# EasyEDA Pro project ExtBoard-001_2024-04-03.epro, schematic Schematic-ExtBoard-001

## Sheets
1 USBHub: Create Date: 2024-03-18; Page Name: USBHub; Project Name: ExtBoard-001; Schematic Name: Schematic-ExtBoard-001; Update Date: 2024-03-18; Company: 嘉立创EDA; Page Size: A4; Version: V1.0
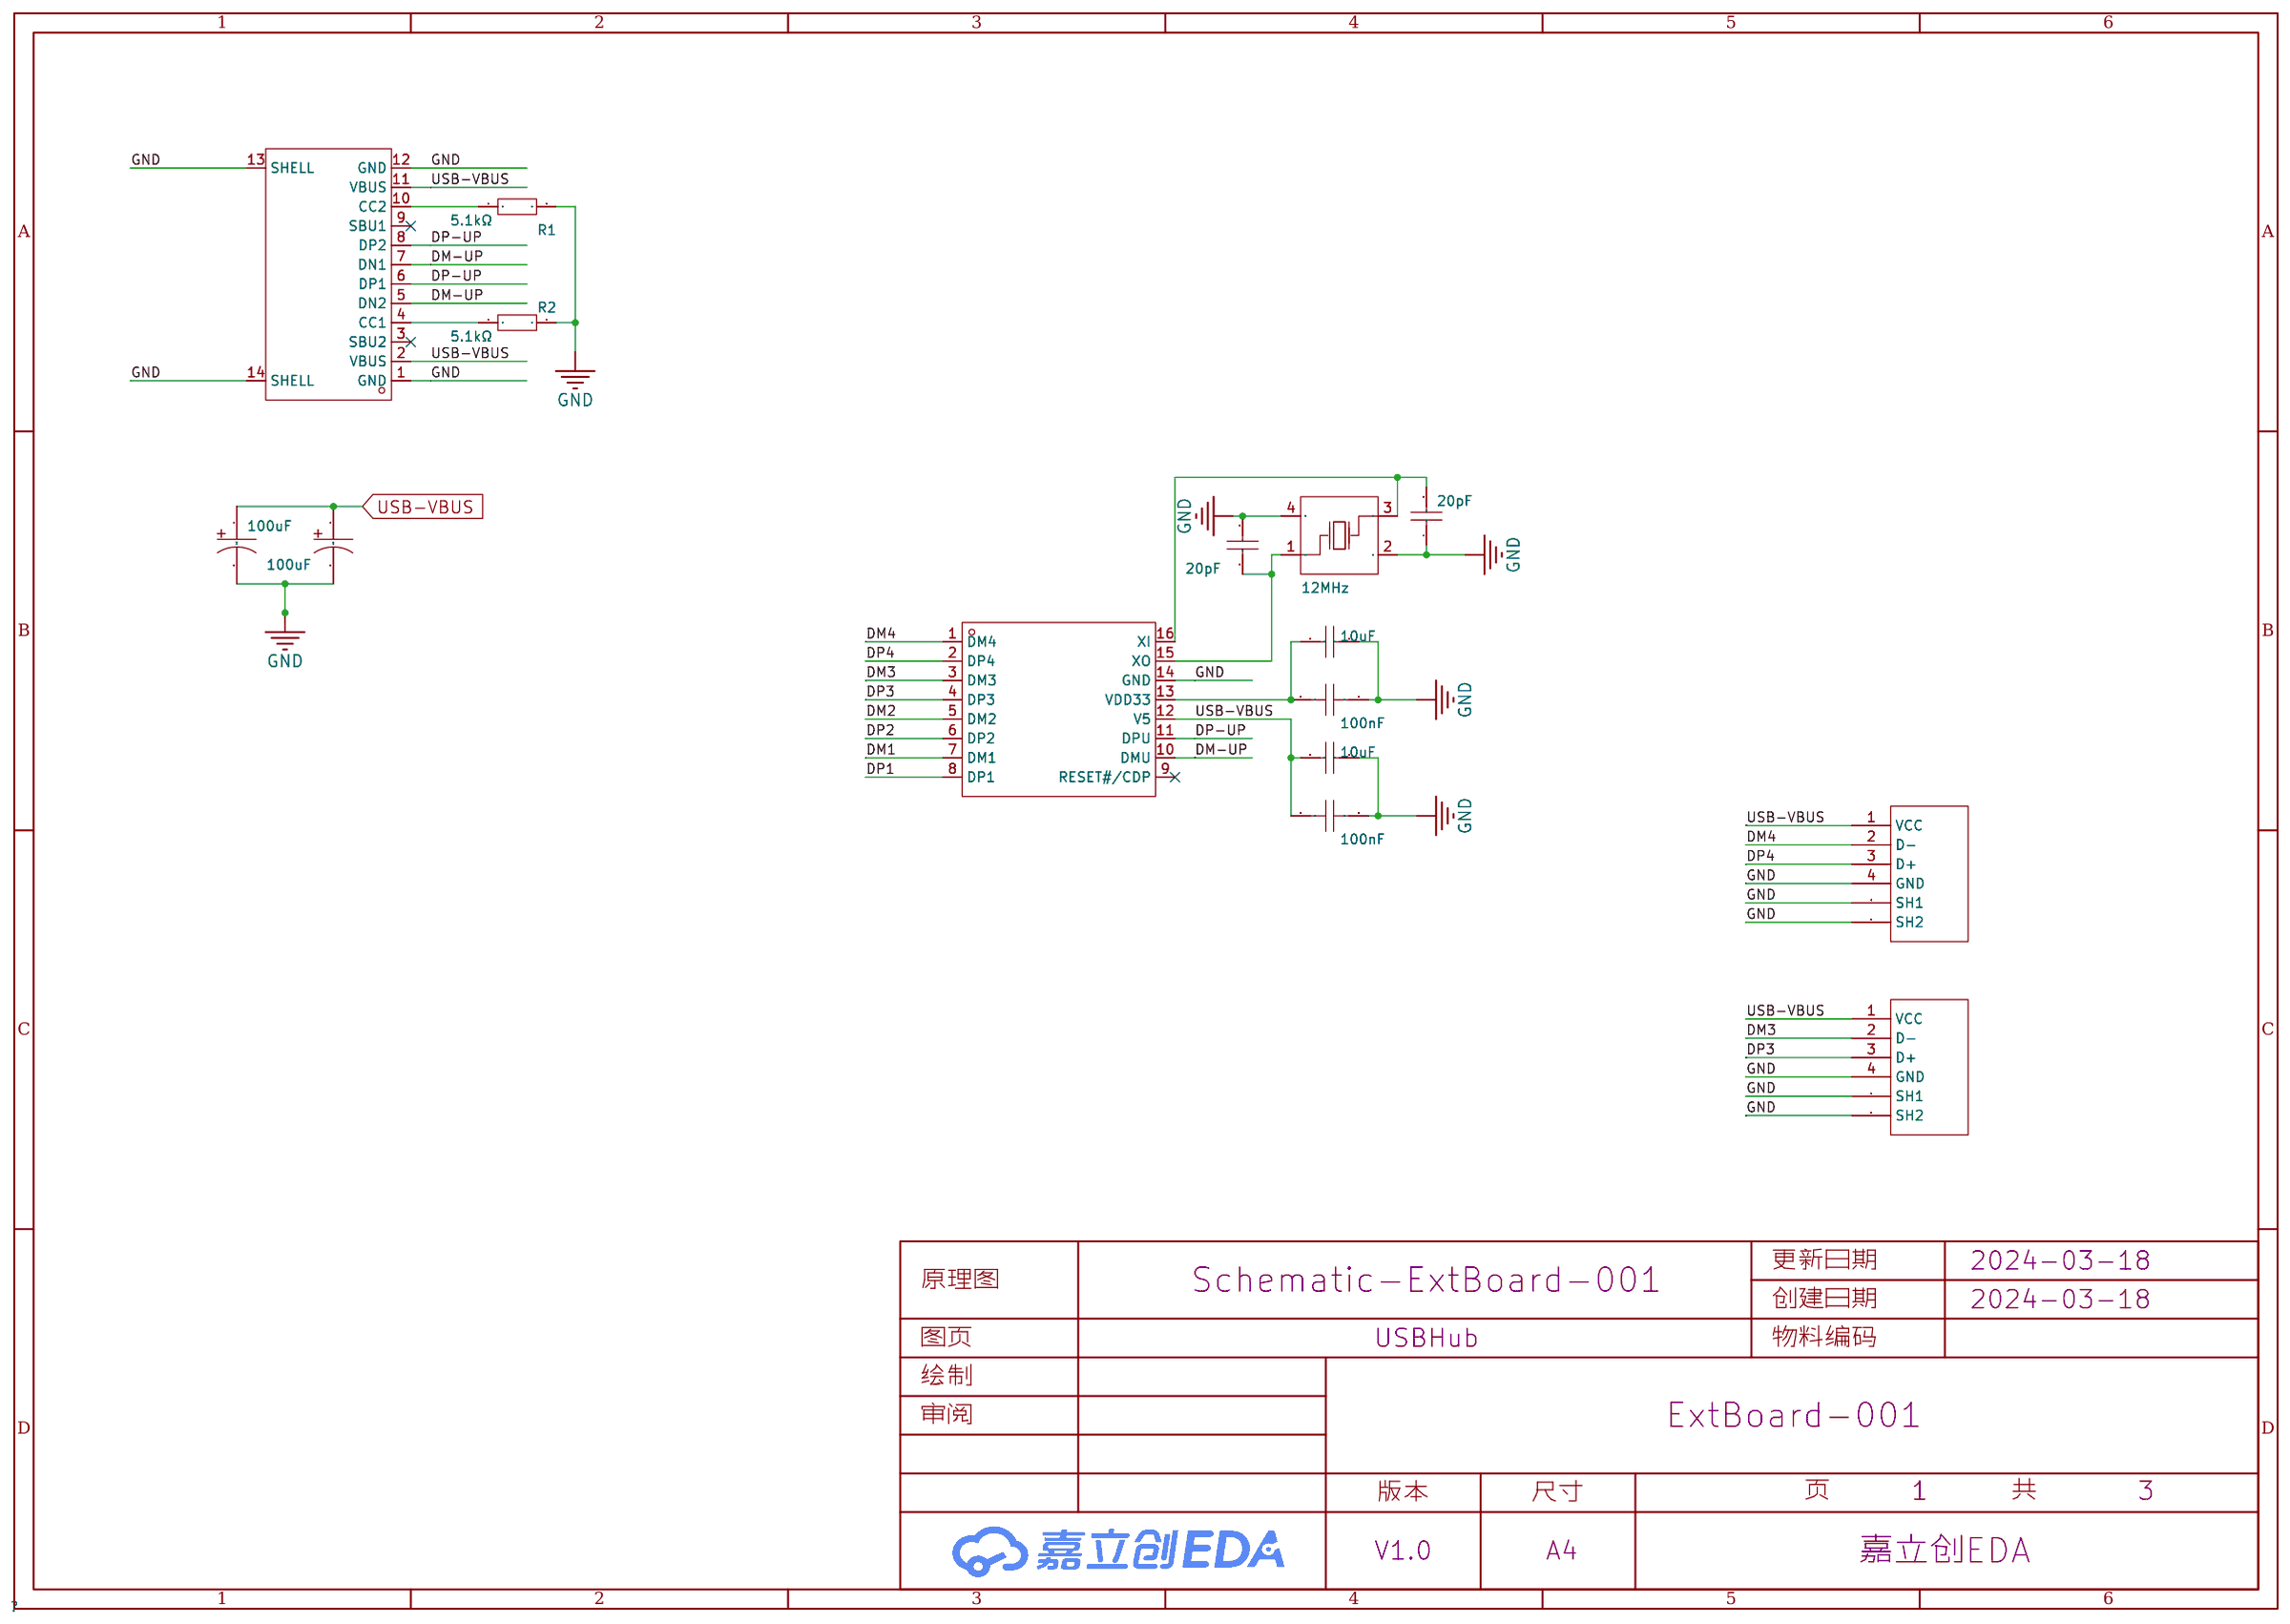
[diagram p0: USBHub]
2 Power: Page Name: Power
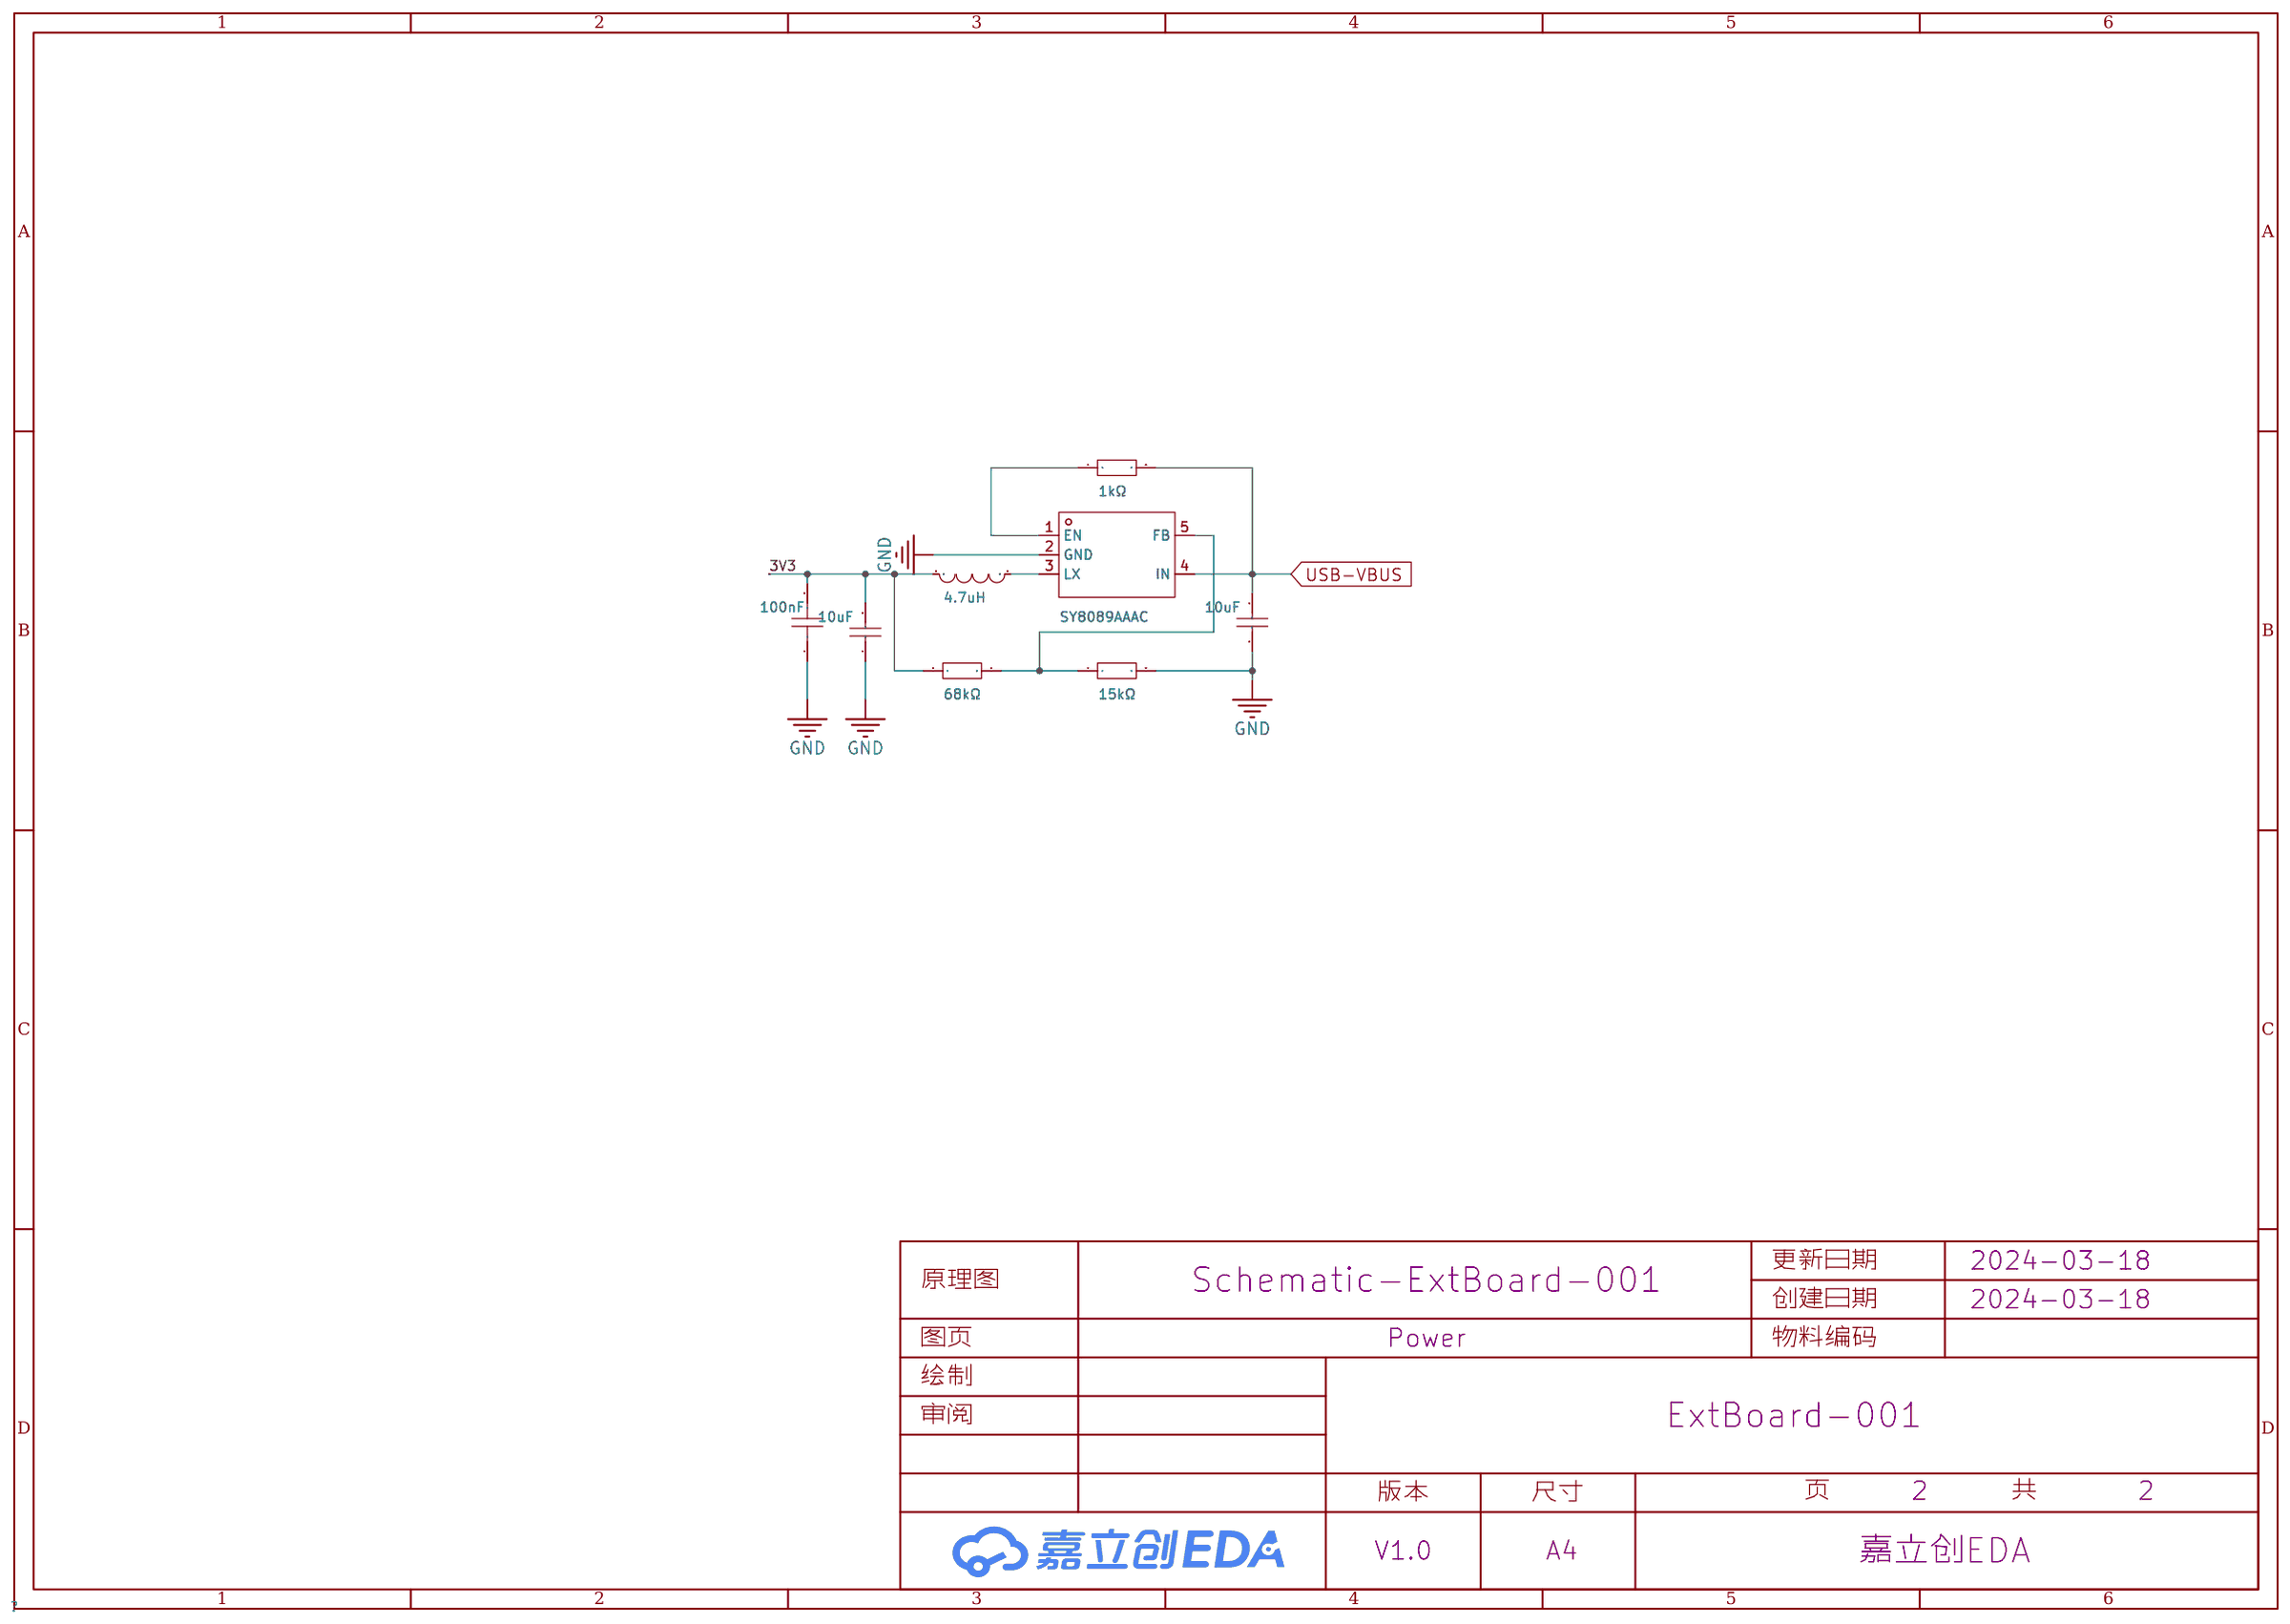
[diagram p1: Power]
3 DAPLink: Page Name: DAPLink; Update Date: 2024-03-27
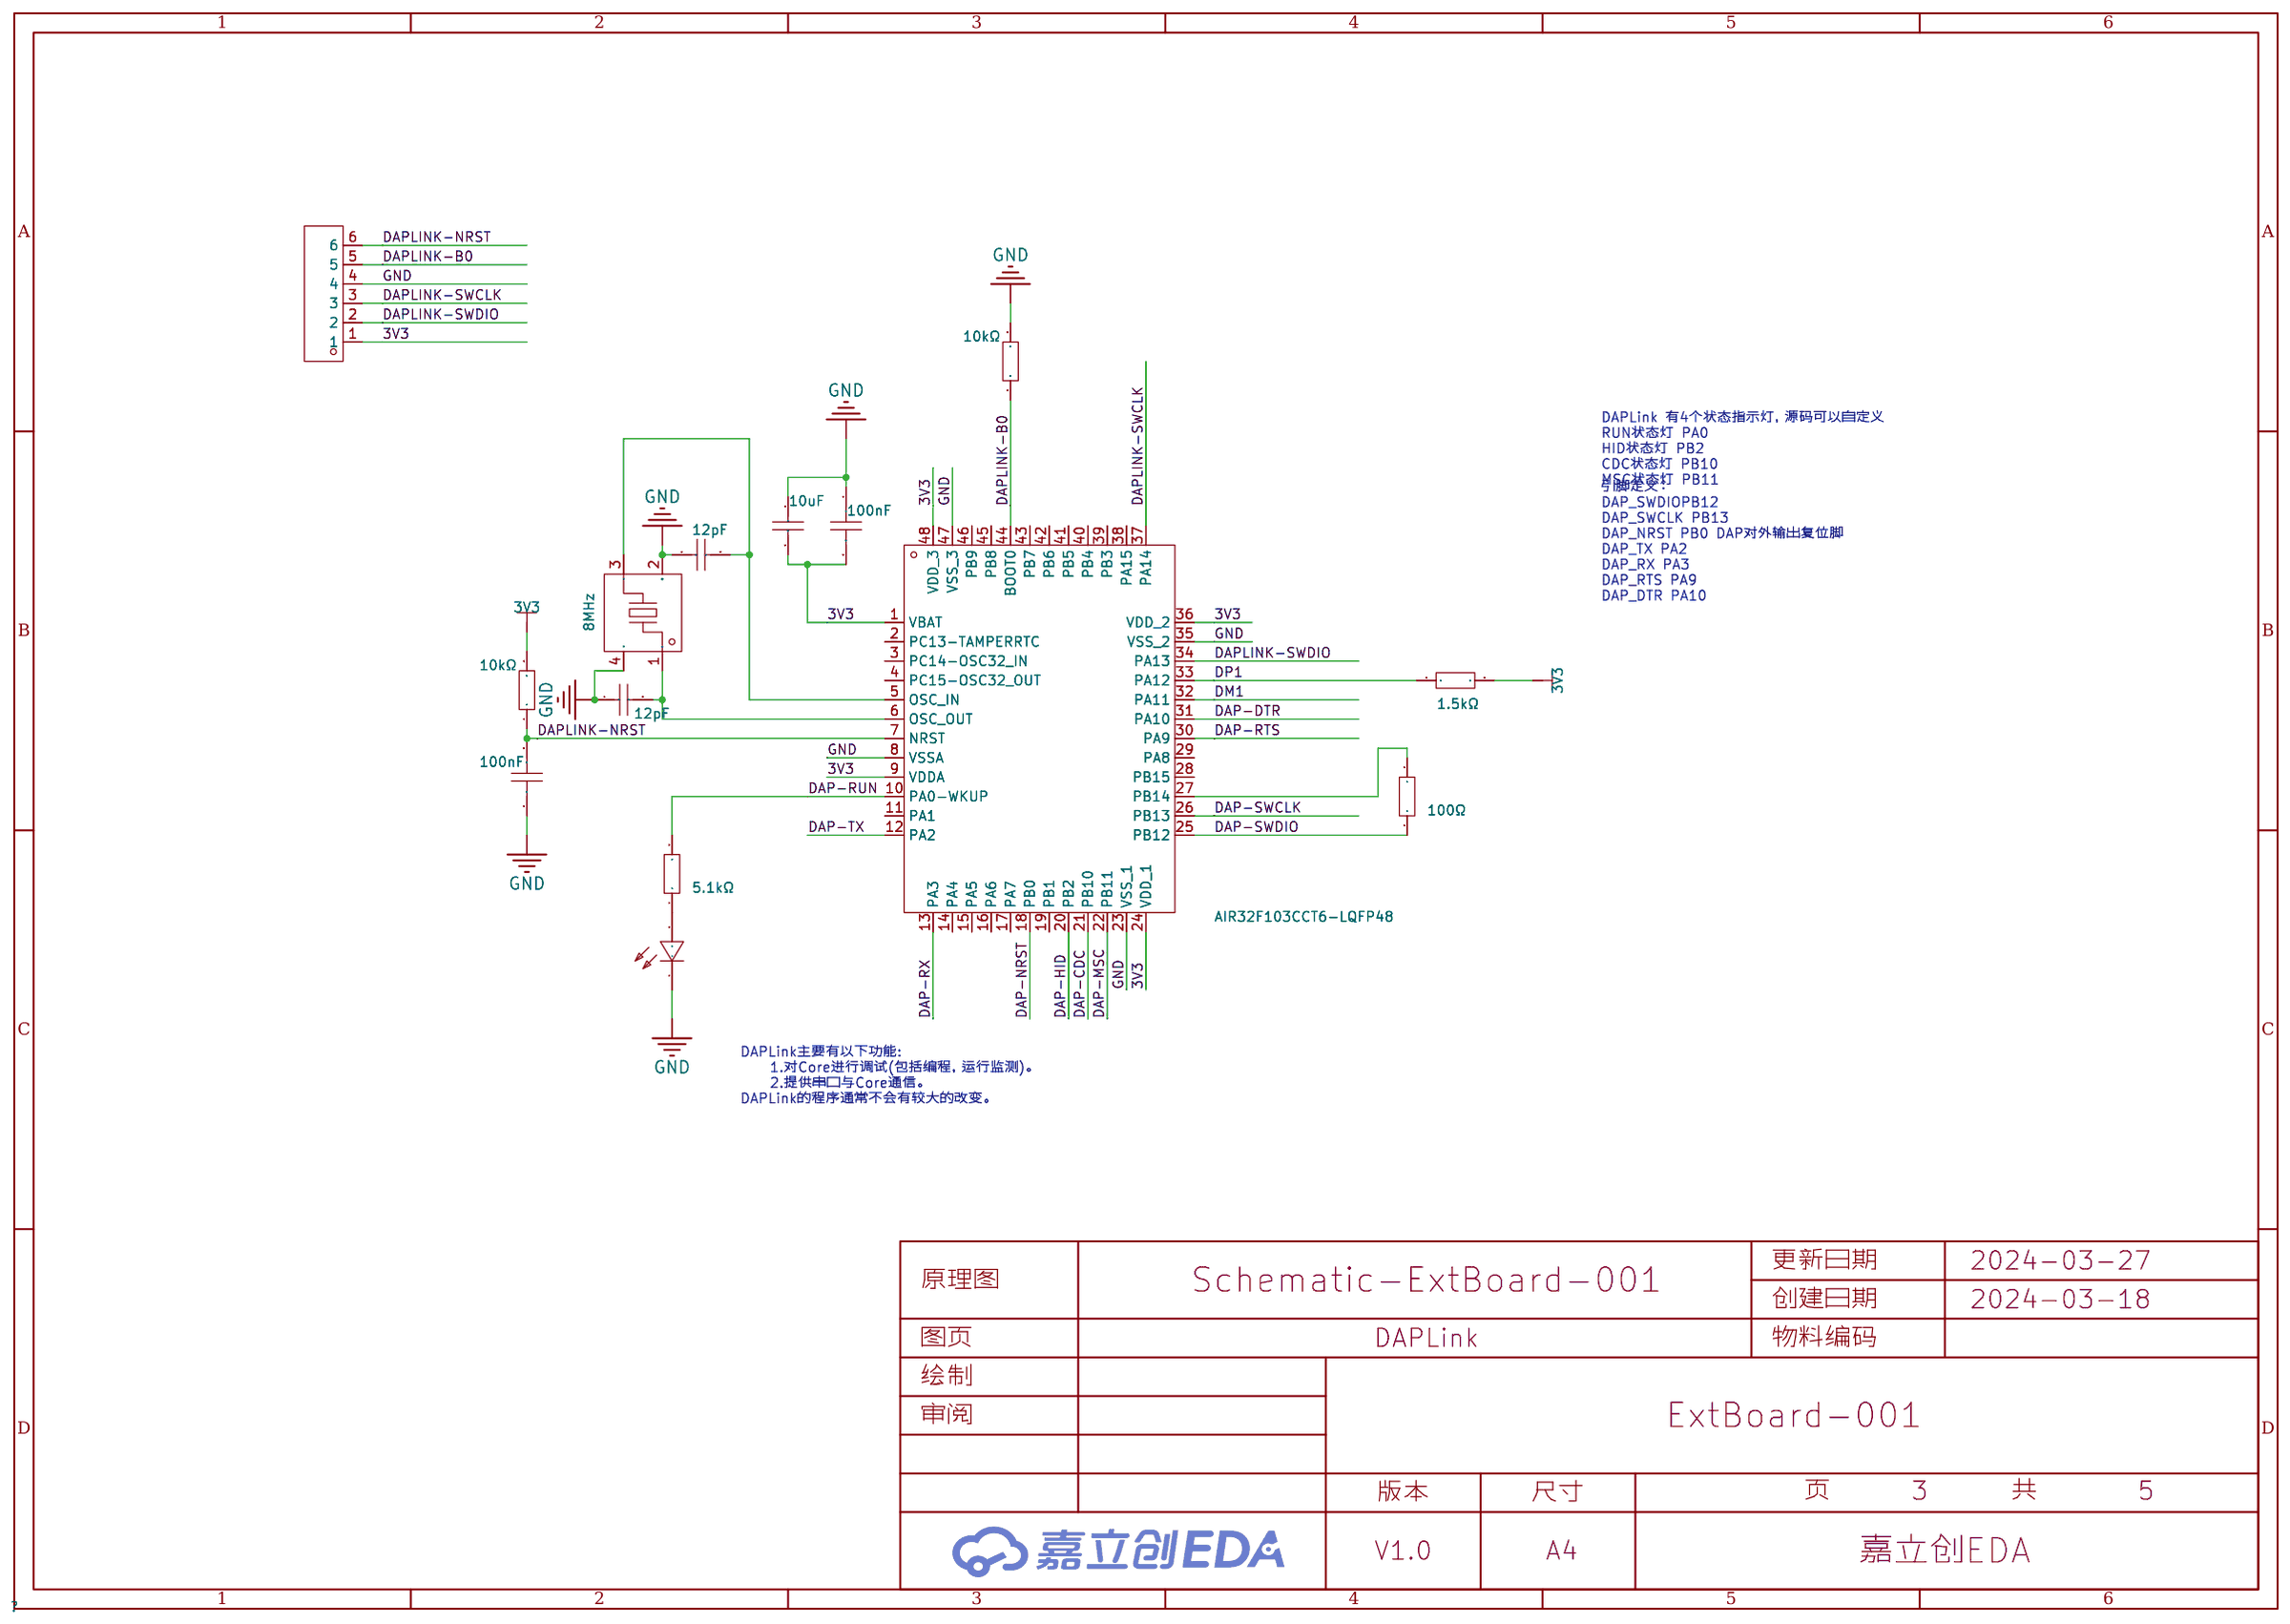
[diagram p2: DAPLink]
4 Core: Create Date: 2024-03-19; Page Name: Core; Update Date: 2024-04-02
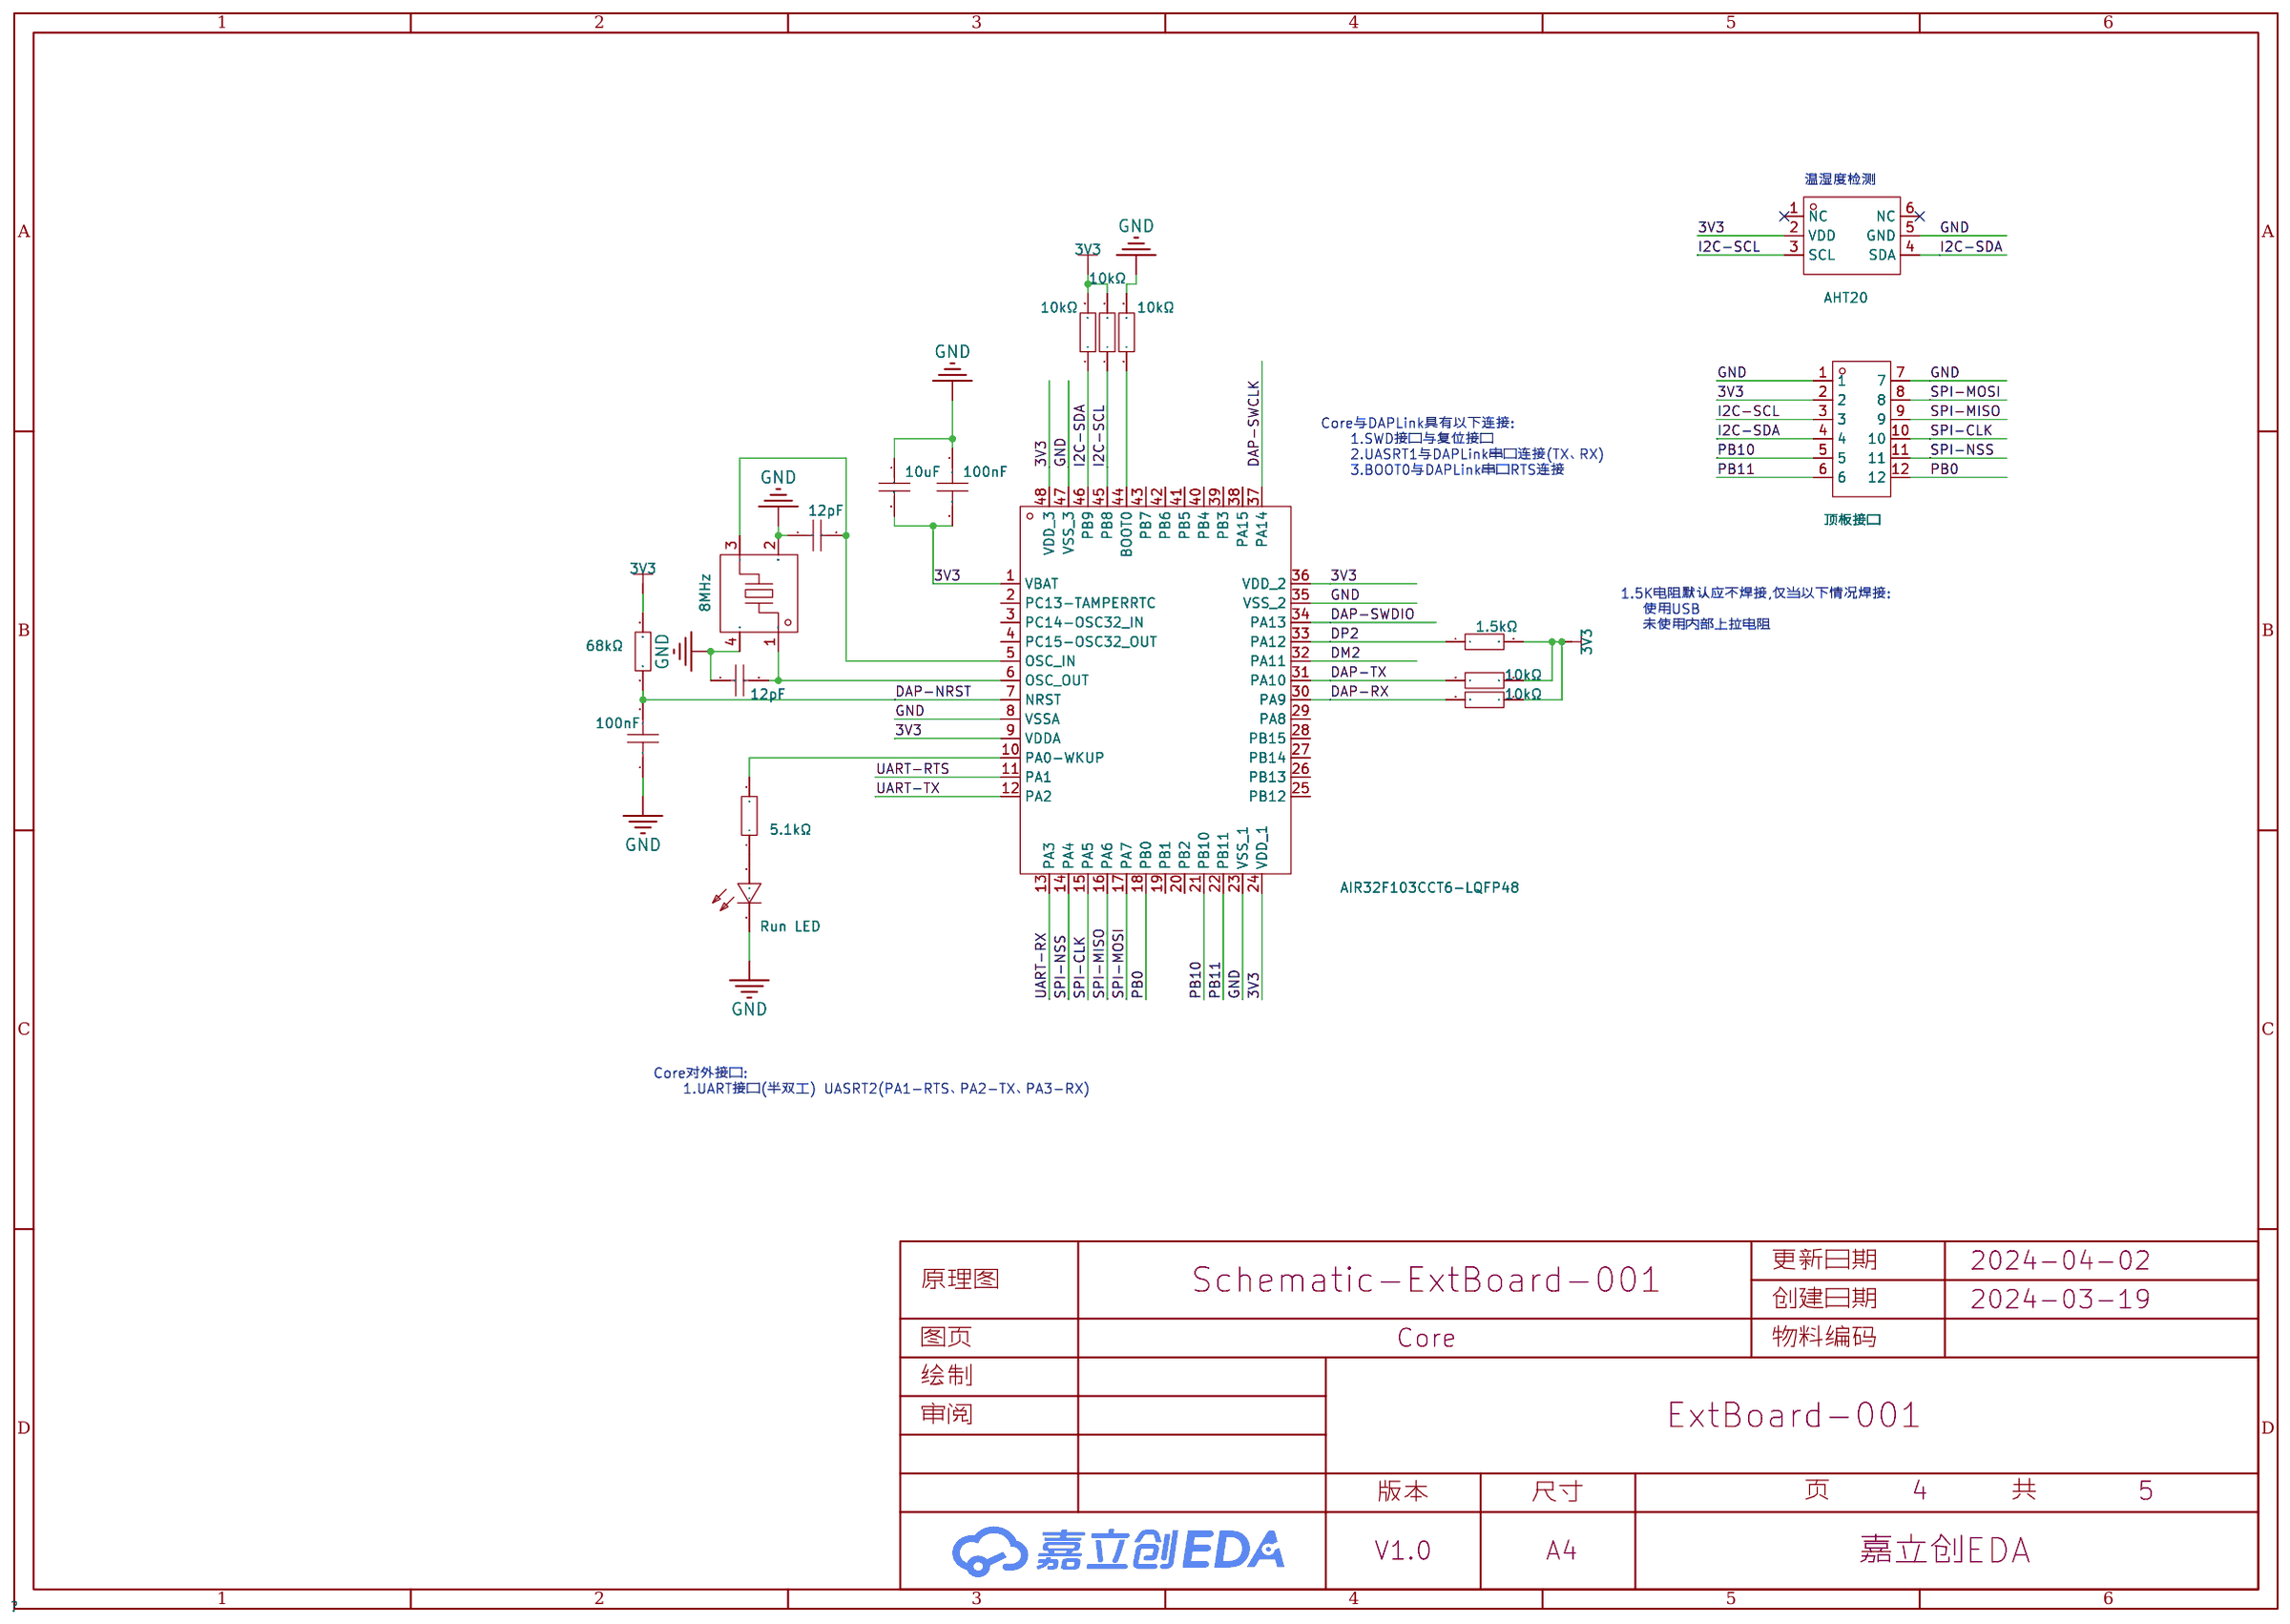
[diagram p3: Core]
5 RS485: Create Date: 2024-03-19; Page Name: RS485; Update Date: 2024-03-19
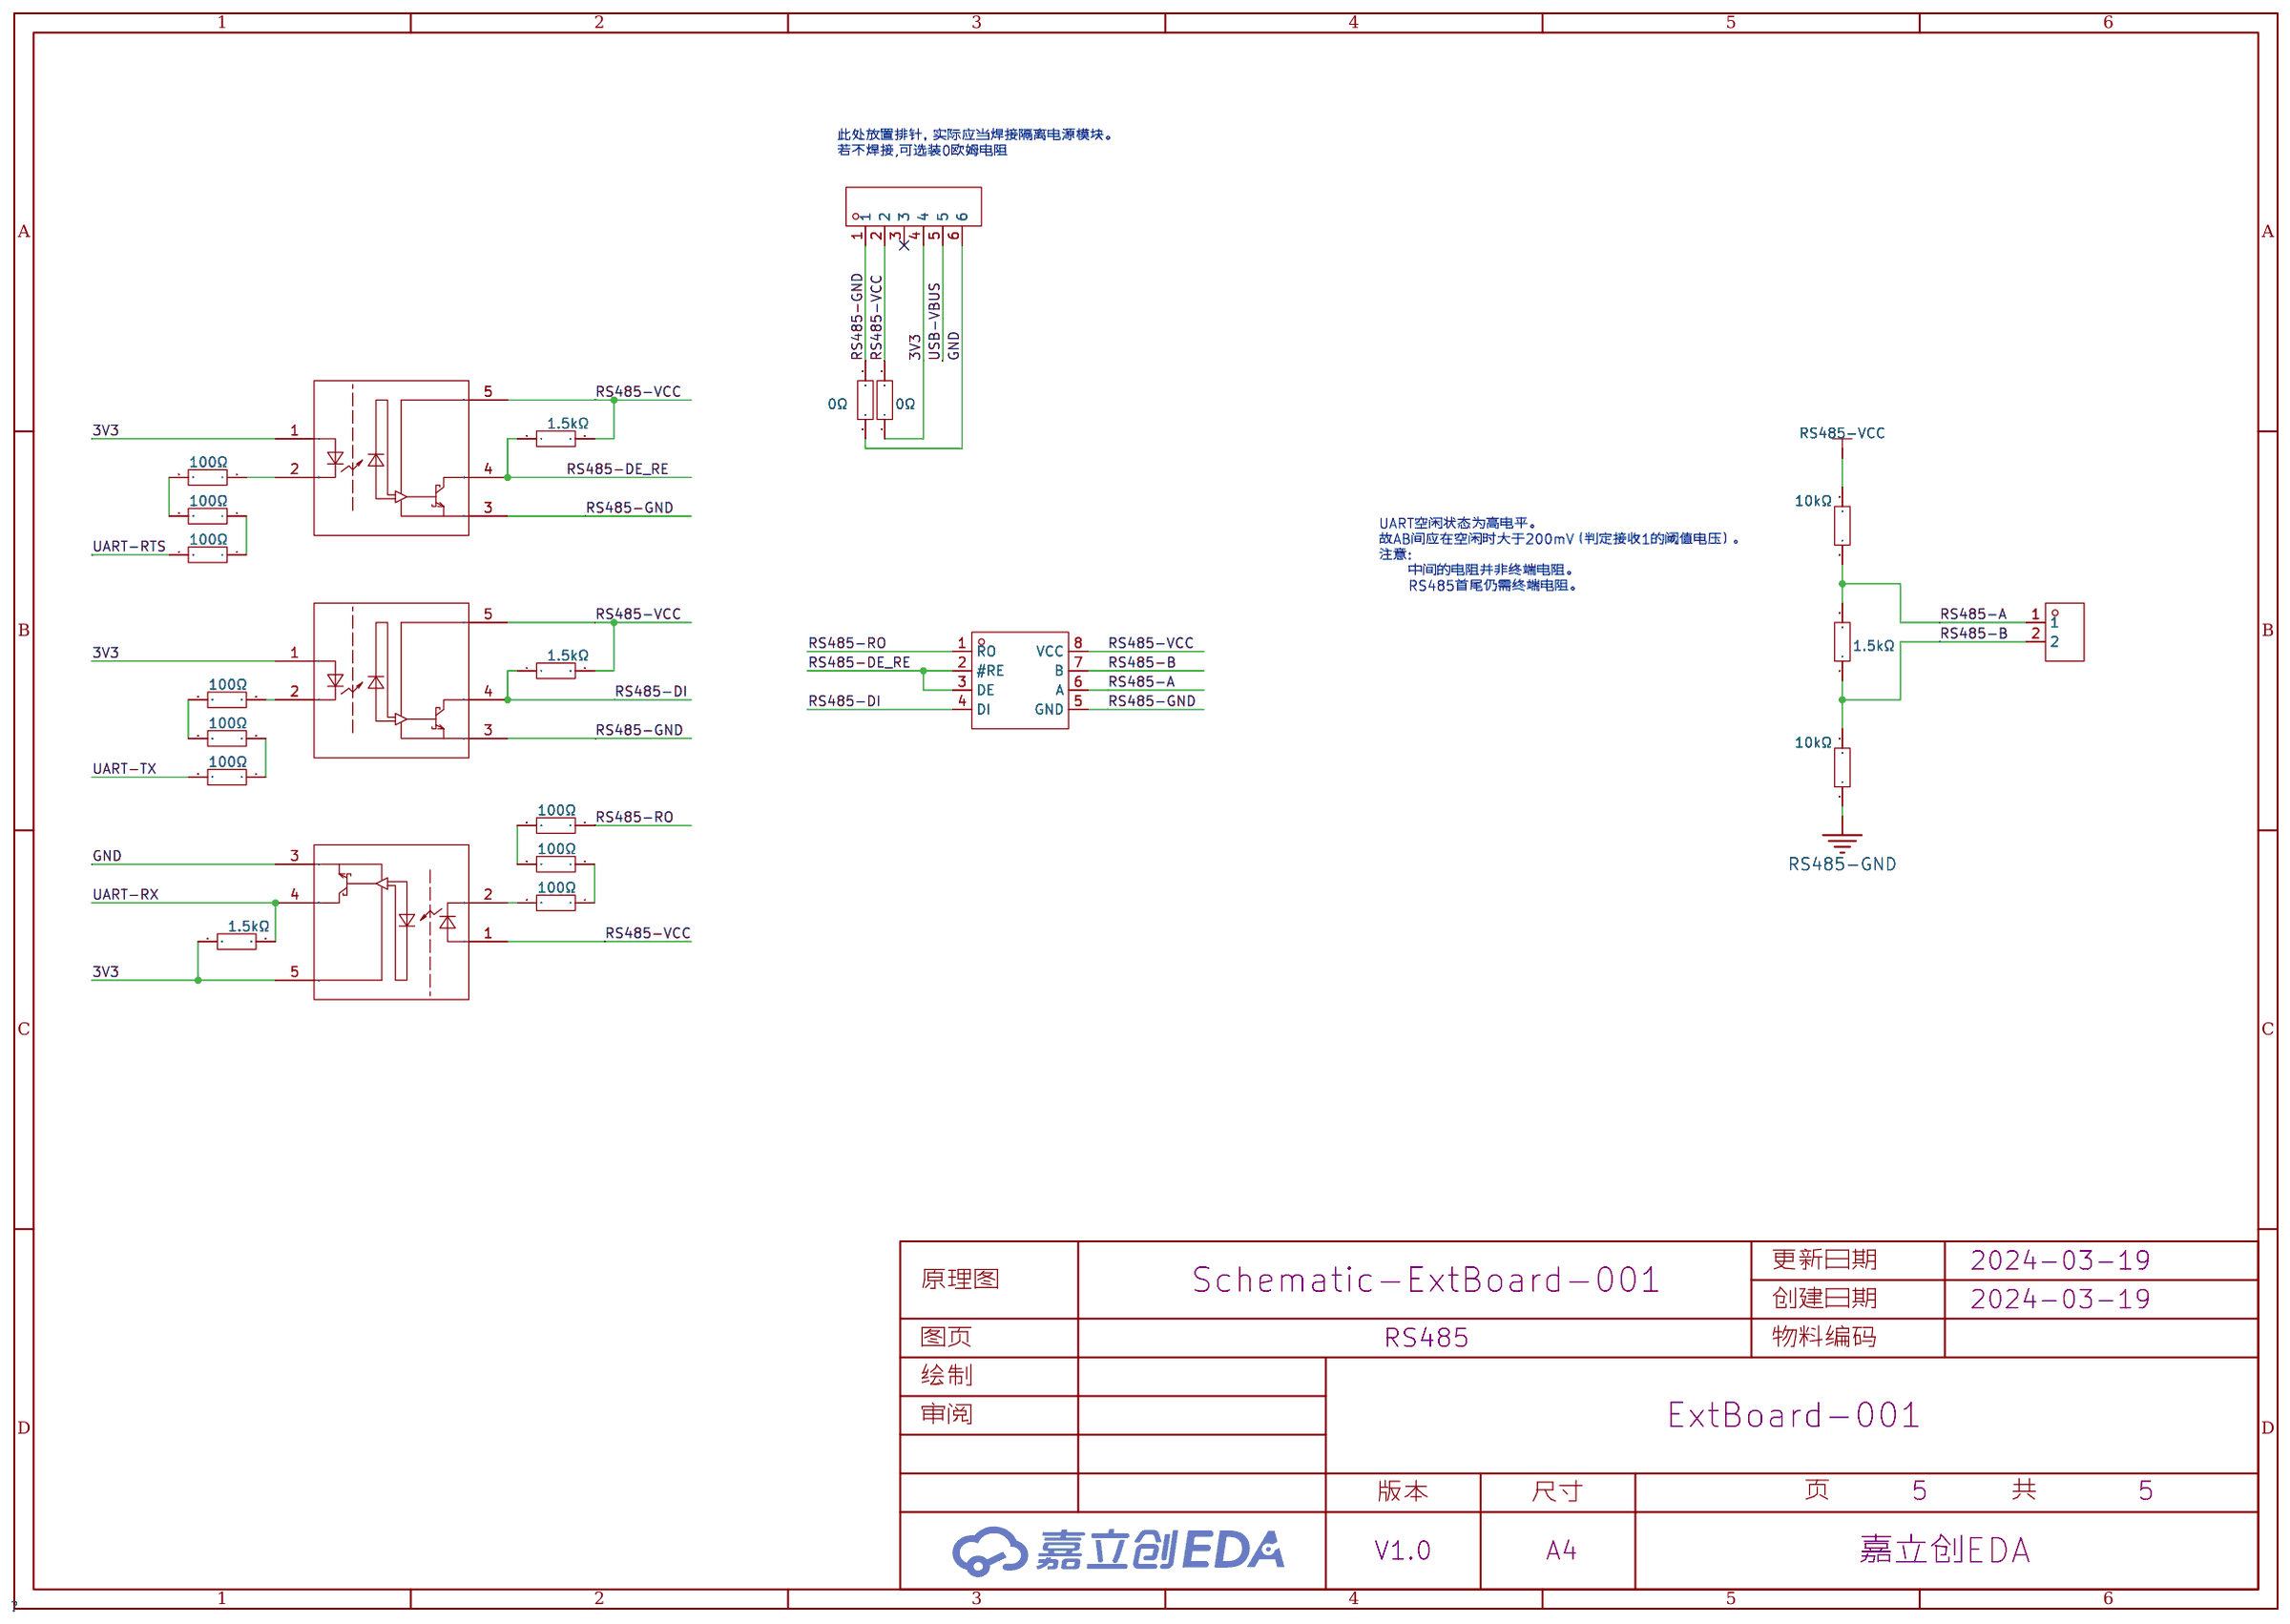
[diagram p4: RS485]

## Parts
sheet Core
C1  10uF  [C0402]
C2  100nF  [C0402]
C9  12pF  [C0402]
C10  12pF  [C0402]
C11  100nF  [C0402]
CN2  顶板接口  [CONN-TH_12P-P2.00_HCTL_HC-PHD]
LED2  Run LED  [LED0603-RD_RED]
R3  10kΩ  [R0402]
R6  1.5kΩ  [R0402]
R7  10kΩ  [R0402]
R8  10kΩ  [R0402]
R18  5.1kΩ  [R0402]
R36  68kΩ  [R0402]
R37  10kΩ  [R0402]
R38  10kΩ  [R0402]
U2  AIR32F103CCT6-LQFP48  [LQFP-48_L7.0-W7.0-P0.50-LS9.0-BL]
U9  AHT20  [SENSOR-SMD_L3.0-W3.0-P1.00-BR]
X3  8MHz  [OSC-SMD_4P-L3.2-W2.5-BL]
sheet DAPLink
C24  100nF  [C0402]
C25  12pF  [C0402]
C26  12pF  [C0402]
C30  10uF  [C0402]
C31  100nF  [C0402]
H1  PZ254-1-06-Z-8.5  [HDR-TH_06P-P2.54-V-M]
LED1  NCD0603R1  [LED0603-RD_RED]
R4  10kΩ  [R0402]
R14  10kΩ  [R0402]
R15  1.5kΩ  [R0402]
R16  100Ω  [R0402]
R17  5.1kΩ  [R0402]
U4  AIR32F103CCT6-LQFP48  [LQFP-48_L7.0-W7.0-P0.50-LS9.0-BL]
X2  8MHz  [OSC-SMD_4P-L3.2-W2.5-BL]
sheet Power
C15  10uF  [C0402]
C16  10uF  [C0402]
C17  100nF  [C0402]
L1  4.7uH  [IND-SMD_L4.0-W4.0]
R11  1kΩ  [R0402]
R12  68kΩ  [R0402]
R13  15kΩ  [R0402]
U3  SY8089AAAC  [SOT-23-5_L3.0-W1.7-P0.95-LS2.8-BR]
sheet RS485
CN1  DB2ERC-3.81-2P-GN  [CONN-TH_2P-P3.81_DB2ERC-3.81-2P]
H2  PZ254V-11-06P  [HDR-TH_6P-P2.54-V-M]
R19  1.5kΩ  [R0402]
R20  10kΩ  [R0402]
R21  10kΩ  [R0402]
R22  1.5kΩ  [R0402]
R23  1.5kΩ  [R0402]
R24  1.5kΩ  [R0402]
R25  100Ω  [R0402]
R26  100Ω  [R0402]
R27  100Ω  [R0402]
R28  100Ω  [R0402]
R29  100Ω  [R0402]
R30  100Ω  [R0402]
R31  100Ω  [R0402]
R32  100Ω  [R0402]
R33  100Ω  [R0402]
R34  0Ω  [R1206]
R35  0Ω  [R1206]
U5  MAX3485ESA  [SOP-8_L5.0-W4.0-P1.27-LS6.0-BL]
U6  MPCM601(T1)-GV  [SOP-5-L4.4-W3.6-P1.27-LS7.0-TL]
U7  MPCM601(T1)-GV  [SOP-5-L4.4-W3.6-P1.27-LS7.0-TL]
U8  MPCM601(T1)-GV  [SOP-5-L4.4-W3.6-P1.27-LS7.0-TL]
sheet USBHub
C3  100nF  [C0402]
C4  10uF  [C0402]
C5  10uF  [C0402]
C6  100nF  [C0402]
C7  20pF  [C0402]
C8  20pF  [C0402]
C22  100uF  [CAP-SMD_BD6.3-L6.6-W6.6-FD]
C23  100uF  [CAP-SMD_BD6.3-L6.6-W6.6-FD]
R1  5.1kΩ  [R0402]
R2  5.1kΩ  [R0402]
U1  CH334R  [QSOP-16_L4.9-W3.9-P0.64-LS6.0-BL]
USB1  TYPE-C 16PIN 2MD(073)  [USB-C-SMD_TYPE-C-6PIN-2MD-073]
USB2  U-USBAR04P-F002  [USB-A-TH_USB-302-T]
USB3  U-USBAR04P-F002  [USB-A-TH_USB-302-T]
X1  12MHz  [OSC-SMD_4P-L3.2-W2.5-BL]

## Library data of the parts
C1 C4 C5 C15 C16 C30 = CL05A106MQ5NUNC: 容值:10uF;精度:±20%;额定电压:6.3V;材质(温度系数):X5R;; LCSC Part Name: 10uF ±20% 6.3V; Supplier Part: C15525; Manufacturer: SAMSUNG(三星); Supplier Footprint: 0402; JLCPCB Part Class: 基础库; Datasheet: https://atta.szlcsc.com/upload/public/pdf/source/20220823/2B02EE04F8F211D38A52DCB16EB6BEBA.pdf; Supplier: LCSC; Tolerance: ±20%; Voltage Rated: 6.3V; Temperature Coefficient: X5R
C2 C3 C6 C11 C17 C24 C31 = CC0402KRX7R7BB104: 容值:100nF;精度:±10%;额定电压:16V;材质(温度系数):X7R;; LCSC Part Name: 100nF ±10% 16V; Supplier Part: C60474; Manufacturer: YAGEO(国巨); Supplier Footprint: 0402; JLCPCB Part Class: Extended Part; Datasheet: https://atta.szlcsc.com/upload/public/pdf/source/20211223/9278FD768280B81DDBEF48FA36411A03.pdf; Supplier: LCSC; Tolerance: ±10%; Voltage Rated: 16V; Temperature Coefficient: X7R
C9 C10 C25 C26 = 0402CG120J500NT: 容值:12pF;精度:±5%;额定电压:50V;材质(温度系数):C0G;; LCSC Part Name: 12pF ±5% 50V; Supplier Part: C1547; Manufacturer: FH(风华); Supplier Footprint: 0402; JLCPCB Part Class: 基础库; Datasheet: https://atta.szlcsc.com/upload/public/pdf/source/20200305/C486355_26A10D38EF8C2A5C37091D0039909270.pdf; Supplier: LCSC; Tolerance: ±5%; Voltage Rated: 50V; Temperature Coefficient: C0G
CN2 = HC-PHD-2*6A: 插针结构:2x6P;间距:2mm;安装方式:直插;参考系列:PHD;总PIN数:12P;排数:2;每排PIN数:6;行距:2mm;额定电流:3A;触头材质:黄铜;触头镀层:锡;工作温度范围:-25℃~+85℃;; LCSC Part Name: 2x6P 间距:2mm 直插 系列:PHD; Supplier Part: C2845617; Manufacturer: HCTL(华灿天禄); Supplier Footprint: 插件,P=2mm; JLCPCB Part Class: 扩展库; Datasheet: https://atta.szlcsc.com/upload/public/pdf/source/20230711/213B911570049296A4498848D3074BCF.pdf; Supplier: LCSC; Pins Structure: 2x6P; Pitch: 2mm; Mounting Style: 直插; Reference Series: PHD; Number of Pins: 12P; Number of Rows: 2; Number of PINs Per Row: 6; Row Spacing: 2mm; Current Rating (Max): 3A; Contact Material: 黄铜; Contact Plating: 锡; Operating Temperature Range: -25℃~+85℃
LED2 = NCD0603R1_C84263: 灯头类型:-;发光颜色:红色;正向电压(VF):1.6V~2.6V;功率:65mW;正向电流:20mA;主波长:615nm~630nm;二极管配置:独立二极管;透镜颜色:无色透明透镜;色温:-;发光强度:80mcd~220mcd;发光角度:130°;载带方式:-;工作温度:-30℃~+85℃;; LCSC Part Name: NCD0603R1; Supplier Part: C84263; Manufacturer: 国星光电; Manufacturer Part: NCD0603R1; Supplier Footprint: 0603; JLCPCB Part Class: 扩展库; Datasheet: https://atta.szlcsc.com/upload/public/pdf/source/20200820/C84263_DABC6A75E58F576973B407FDBA283D60.pdf; Supplier: LCSC; Emitted Color: 红色; Forward Voltage (VF): 1.6V~2.6V; Power Dissipation: 65mW; Forward Current: 20mA; Dominant Wavelength: 615nm~630nm; Diode Configuration: 独立二极管; Lens Color: 无色透明透镜; Luminous Intensity: 80mcd~220mcd; Viewing Angle: 130°; Operating Temperature: -30℃~+85℃
R3 R4 R7 R8 R14 R20 R21 R37 R38 = RC0402FR-0710KL: 电阻类型:厚膜电阻;阻值:10kΩ;精度:±1%;功率:62.5mW;最大工作电压:50V;温度系数:±100ppm/℃;; LCSC Part Name: 厚膜电阻 10kΩ ±1% 62.5mW; Supplier Part: C60490; Manufacturer: YAGEO(国巨); Supplier Footprint: 0402; JLCPCB Part Class: 扩展库; Datasheet: https://atta.szlcsc.com/upload/public/pdf/source/20170925/C131467_1506321478108990263.pdf; Supplier: LCSC; Type: 厚膜电阻; Tolerance: ±1%; Power(Watts): 62.5mW; Overload Voltage (Max): 50V; Temperature Coefficient: ±100ppm/℃; Operating Temperature Range: -55℃~+155℃
R6 R15 R19 R22-R24 = 0402WGF1501TCE: 电阻类型:厚膜电阻;阻值:1.5kΩ;精度:±1%;功率:62.5mW;最大工作电压:50V;温度系数:±100ppm/℃;; LCSC Part Name: 1.5kΩ ±1% 62.5mW 厚膜电阻; Supplier Part: C25867; Manufacturer: UNI-ROYAL(厚声); Supplier Footprint: 0402; JLCPCB Part Class: Basic Part; Datasheet: https://atta.szlcsc.com/upload/public/pdf/source/20200306/C422600_1E6D84923E4A46A82E41ADD87F860B5C.pdf; Supplier: LCSC; Type: 厚膜电阻; Tolerance: ±1%; Power(Watts): 62.5mW; Overload Voltage (Max): 50V; Temperature Coefficient: ±100ppm/℃; Operating Temperature Range: -55℃~+155℃
R1 R2 R17 R18 = 0402WGF5101TCE: 阻值:5.1kΩ;精度:±1%;功率:62.5mW;温度系数:±100ppm/℃;电阻类型:厚膜电阻;; LCSC Part Name: 5.1kΩ ±1% 62.5mW 厚膜电阻; Supplier Part: C25905; Manufacturer: UNI-ROYAL(厚声); Supplier Footprint: 0402; JLCPCB Part Class: Basic Part; Datasheet: https://atta.szlcsc.com/upload/public/pdf/source/20200306/C422600_1E6D84923E4A46A82E41ADD87F860B5C.pdf; Supplier: LCSC; Tolerance: ±1%; Power(Watts): 62.5mW; Overload Voltage (Max): 50V; Temperature Coefficient: ±100ppm/℃; Type: 厚膜电阻; Operating Temperature Range: -55℃~+155℃
R12 R36 = 0402WGF6802TCE: 阻值:68kΩ;精度:±1%;功率:62.5mW;温度系数:±100ppm/℃;电阻类型:厚膜电阻;; LCSC Part Name: 68kΩ ±1% 62.5mW 厚膜电阻; Supplier Part: C36871; Manufacturer: UNI-ROYAL(厚声); Supplier Footprint: 0402; JLCPCB Part Class: Basic Part; Datasheet: https://atta.szlcsc.com/upload/public/pdf/source/20200306/C422600_1E6D84923E4A46A82E41ADD87F860B5C.pdf; Supplier: LCSC; Tolerance: ±1%; Power(Watts): 62.5mW; Overload Voltage (Max): 50V; Temperature Coefficient: ±100ppm/℃; Type: 厚膜电阻; Operating Temperature Range: -55℃~+155℃
U2 U4 = AIR32F103CBT6-LQFP48: Supplier Part: C9900021638; Supplier Footprint: LQFP-48(7x7); JLCPCB Part Class: 扩展库; Supplier: LCSC
U9 = AHT20: Supplier Part: C2757850; Manufacturer: 广州奥松; Supplier Footprint: SMD; JLCPCB Part Class: 扩展库; Datasheet: https://atta.szlcsc.com/upload/public/pdf/source/20231023/00557B34ED120268320A4810FF8DED4D.pdf; Supplier: LCSC
X2 X3 = X32258MOB4SI: 晶振类型:贴片晶振;频率:8MHz;常温频差:±10ppm;外接负载电容:12pF;频率稳定度(全温):±30ppm;; LCSC Part Name: 8MHz ±10ppm 12pF; Supplier Part: C2682775; Manufacturer: YXC(扬兴晶振); Supplier Footprint: SMD3225-4P; JLCPCB Part Class: 扩展库; Datasheet: https://atta.szlcsc.com/upload/public/pdf/source/20210106/C2682774_0CD4FDA5D9DA3FBEEC23BD607A48E4B0.pdf; Supplier: LCSC; Crystal Type: 贴片晶振; Normal temperature Frequency Tolerance: ±10ppm; External load capacitor: 12pF; Frequency Stability(Full temperature range): ±30ppm; Equivalent Series Resistance (ESR): 150Ω; Operating Temperature: -40℃~+85℃
H1 = PZ254-1-06-Z-8.5: 插针结构:1x6P;间距:2.54mm;行距:-;圆针/方针:方针;安装类型:直插;排数:单排;总PIN位数:6P;额定电流:3A;额定电压:-;配合针长度:6mm;塑高:2.5mm;端接针长度:3mm;触头材质:黄铜;工作温度范围:-40℃~+105℃;焊接温度(最大值):260℃@10S;颜色:黑色;; LCSC Part Name: 1x6P 间距:2.54mm 方针 直插; Supplier Part: C2894929; Manufacturer: HCTL(华灿天禄); Supplier Footprint: 插件,P=2.54mm; JLCPCB Part Class: Extended Part; Datasheet: https://atta.szlcsc.com/upload/public/pdf/source/20230609/805D25CEF03592837AF6F506EEB5ED41.pdf; Supplier: LCSC; Pin Structure: 1x6P; Pitch: 2.54mm; Circluar Pins/Square Pins: 方针; Mounting Type: 直插; Number of Rows: 单排; Number of Pins: 6P; Current Rating (Max): 3A; Length of Mating Pin: 6mm; Insulation Height: 2.5mm; Length of End Connection Pin: 3mm; Contact Material: 黄铜; Operating Temperature Range: -40℃~+105℃; Soldering Temperature(Max): 260℃@10S; Color: 黑色
LED1 = NCD0603R1_C84263: 灯头类型:-;发光颜色:红色;正向电压(VF):1.6V~2.6V;功率:65mW;正向电流:20mA;主波长:615nm~630nm;二极管配置:独立二极管;透镜颜色:无色透明透镜;色温:-;发光强度:80mcd~220mcd;发光角度:130°;载带方式:-;工作温度:-30℃~+85℃;; Supplier Part: C84263; Manufacturer: 国星光电; Supplier Footprint: 0603; JLCPCB Part Class: 扩展库; Datasheet: https://atta.szlcsc.com/upload/public/pdf/source/20200820/C84263_DABC6A75E58F576973B407FDBA283D60.pdf; Supplier: LCSC; Emitted Color: 红色; Forward Voltage (VF): 1.6V~2.6V; Power Dissipation: 65mW; Forward Current: 20mA; Dominant Wavelength: 615nm~630nm; Diode Configuration: 独立二极管; Lens Color: 无色透明透镜; Luminous Intensity: 80mcd~220mcd; Viewing Angle: 130°; Operating Temperature: -30℃~+85℃
R16 R25-R33 = 0402WGF1000TCE: 电阻类型:厚膜电阻;阻值:100Ω;精度:±1%;功率:62.5mW;最大工作电压:50V;温度系数:±200ppm/℃;; LCSC Part Name: 100Ω ±1% 62.5mW 厚膜电阻; Supplier Part: C25076; Manufacturer: UNI-ROYAL(厚声); Supplier Footprint: 0402; JLCPCB Part Class: Basic Part; Datasheet: https://atta.szlcsc.com/upload/public/pdf/source/20200306/C422600_1E6D84923E4A46A82E41ADD87F860B5C.pdf; Supplier: LCSC; Type: 厚膜电阻; Tolerance: ±1%; Power(Watts): 62.5mW; Overload Voltage (Max): 50V; Temperature Coefficient: ±200ppm/℃; Operating Temperature Range: -55℃~+155℃
L1 = SWPA4030S4R7MT: 直流电阻(DCR):78mΩ;精度:±20%;电感值:4.7uH;额定电流:2A;; LCSC Part Name: 4.7uH ±20%; Supplier Part: C57269; Manufacturer: Sunlord(顺络); Supplier Footprint: SMD; JLCPCB Part Class: 扩展库; Datasheet: https://atta.szlcsc.com/upload/public/pdf/source/20161024/1477287957557.pdf; Supplier: LCSC; DC Resistance (DCR): 78mΩ; Tolerance: ±20%; Height: 3mm; Width: 4mm; Rated Current: 2A; Length: 4mm
R11 = 0402WGF1001TCE: 阻值:1kΩ;精度:±1%;功率:62.5mW;温度系数:±100ppm/℃;电阻类型:厚膜电阻;; LCSC Part Name: 1kΩ ±1% 62.5mW 厚膜电阻; Supplier Part: C11702; Manufacturer: UNI-ROYAL(厚声); Supplier Footprint: 0402; JLCPCB Part Class: 基础库; Datasheet: https://atta.szlcsc.com/upload/public/pdf/source/20200306/C422600_1E6D84923E4A46A82E41ADD87F860B5C.pdf; Supplier: LCSC; Tolerance: ±1%; Power(Watts): 62.5mW; Overload Voltage (Max): 50V; Temperature Coefficient: ±100ppm/℃; Type: 厚膜电阻; Operating Temperature Range: -55℃~+155℃
R13 = 0402WGF1502TCE: 阻值:15kΩ;精度:±1%;功率:62.5mW;温度系数:±100ppm/℃;电阻类型:厚膜电阻;; LCSC Part Name: 15kΩ ±1% 62.5mW 厚膜电阻; Supplier Part: C25756; Manufacturer: UNI-ROYAL(厚声); Supplier Footprint: 0402; JLCPCB Part Class: Basic Part; Datasheet: https://atta.szlcsc.com/upload/public/pdf/source/20200306/C422600_1E6D84923E4A46A82E41ADD87F860B5C.pdf; Supplier: LCSC; Tolerance: ±1%; Power(Watts): 62.5mW; Overload Voltage (Max): 50V; Temperature Coefficient: ±100ppm/℃; Type: 厚膜电阻; Operating Temperature Range: -55℃~+155℃
U3 = SY8089AAAC: 功能类型:降压型;同步整流:-;输出通道数:-;拓扑结构:-;输入电压:-;输出电流(最大值):-;开关频率:-;; LCSC Part Name: 降压型; Supplier Part: C78988; Manufacturer: silergy(矽力杰); Supplier Footprint: SOT-23-5; JLCPCB Part Class: 扩展库; Datasheet: https://atta.szlcsc.com/upload/public/pdf/source/20210826/394049C81A2AF57A190C26FDBC282657.pdf; Supplier: LCSC; Function: 降压型
CN1 = DB2ERC-3.81-2P-GN: 连接器类型:板端/插座-闭口;结构:1x2P;间距:3.81mm;颜色:绿色;安装方式:弯针;排数:1;每排PIN数:2;额定电流:10A;额定电压:250V;工作温度范围:-40℃~+105℃;; LCSC Part Name: 3.81mm 1x2P 排数:1 每排P数:2; Supplier Part: C395684; Manufacturer: DORABO(地博电气); Supplier Footprint: 弯插,P=3.81mm; JLCPCB Part Class: 扩展库; Datasheet: https://atta.szlcsc.com/upload/public/pdf/source/20221115/4E217E7D538220F8720C137D6A05E519.pdf; Supplier: LCSC; Connector Type: 板端/插座-闭口; Structure: 1x2P; Pitch: 3.81mm; Color: 绿色; Mounting Style: 弯针; Number of Pins: 2P; Number of Rows: 1; Number of PINs Per Row: 2; Current Rating (Max): 10A; Voltage Rating (Max): 250V; Operating Temperature Range: -40℃~+105℃
H2 = PZ254V-11-06P: 插针结构:1x6P;间距:2.54mm;行距:-;圆针/方针:方针;安装类型:直插;排数:单排;总PIN位数:6P;额定电流:-;额定电压:-;配合针长度:6mm;塑高:2.5mm;端接针长度:3mm;触头材质:黄铜;触头镀层:-;工作温度范围:-40℃~+105℃;颜色:黑色;; LCSC Part Name: 间距:2.54mm 1x6P 直插 方针; Supplier Part: C492405; Manufacturer: XFCN(兴飞); Supplier Footprint: 插件,P=2.54mm; JLCPCB Part Class: 扩展库; Datasheet: https://atta.szlcsc.com/upload/public/pdf/source/20200309/C492405_597F1930F5B55CC3C7FD95458F1C3977.pdf; Supplier: LCSC; Pin Structure: 1x6P; Pitch: 2.54mm; Circluar Pins/Square Pins: 方针; Mounting Type: 直插; Number of Rows: 单排; Number of Pins: 6P; Length of Mating Pin: 6mm; Insulation Height: 2.5mm; Length of End Connection Pin: 3mm; Contact Material: 黄铜; Operating Temperature Range: -40℃~+105℃; Color: 黑色
R34 R35 = 1206W4F0000T5E: 电阻类型:厚膜电阻;阻值:0Ω;精度:±1%;功率:250mW;最大工作电压:200V;温度系数:±800ppm/℃;; LCSC Part Name: 0Ω ±1% 250mW 厚膜电阻; Supplier Part: C17888; Manufacturer: UNI-ROYAL(厚声); Supplier Footprint: 1206; JLCPCB Part Class: 基础库; Datasheet: https://atta.szlcsc.com/upload/public/pdf/source/20200306/C422600_1E6D84923E4A46A82E41ADD87F860B5C.pdf; Supplier: LCSC; Type: 厚膜电阻; Tolerance: ±1%; Power(Watts): 250mW; Overload Voltage (Max): 200V; Temperature Coefficient: ±800ppm/℃; Operating Temperature Range: -55℃~+155℃
U5 = MAX3485ESA: 类型:收发器;数据速率:12Mbps;驱动器/接收器:1/1;; Supplier Part: C668204; Manufacturer: UMW(友台半导体); Supplier Footprint: SOP-8; JLCPCB Part Class: 扩展库; Datasheet: https://atta.szlcsc.com/upload/public/pdf/source/20231109/DDD7CD3D891754087D6BC3897133907F.pdf; Supplier: LCSC; Types: 收发器; Supply Voltage: 2.97V~3.63V; Data Rate: 12Mbps; Driver/receiver: 1/1; Operating Temperature: -40℃~+85℃
U6-U8 = MPCM601(T1)-GV: 输入类型:DC;电源电压:4.5V~5.5V；2.7V~3.6V;共模瞬变抗扰度CMTI:10kV/us;数据速率:15Mbit/s;传播延迟tpLH/tpHL:75ns；90ns;; Supplier Part: C17701959; Manufacturer: MTC(美禄); Supplier Footprint: SOP-5; Datasheet: https://atta.szlcsc.com/upload/public/pdf/source/20230919/9A8DA33CA451D6CDF437FAD0AB8A07AA.pdf; Supplier: LCSC; Input Type: DC; Supply Voltage: 4.5V~5.5V；2.7V~3.6V; Common Mode Transient Immunity (CMTI): 10kV/us; Data Rate: 15Mbit/s; Propagation Delay tpLH/tpHL: 75ns；90ns
C7 C8 = 0402CG200J500NT: 容值:20pF;精度:±5%;额定电压:50V;材质(温度系数):C0G;; LCSC Part Name: 20pF ±5% 50V; Supplier Part: C1554; Manufacturer: FH(风华); Supplier Footprint: 0402; JLCPCB Part Class: Basic Part; Datasheet: https://atta.szlcsc.com/upload/public/pdf/source/20200305/C486355_26A10D38EF8C2A5C37091D0039909270.pdf; Supplier: LCSC; Tolerance: ±5%; Voltage Rated: 50V; Temperature Coefficient: C0G
C22 C23 = VEZ101M1CTR-0605: 容值:100uF;精度:±20%;额定电压:16V;纹波电流:-;等效串联电阻:-;; LCSC Part Name: 100uF ±20% 16V; Supplier Part: C249766; Manufacturer: lelon(立隆); Supplier Footprint: SMD,D6.3xL5.3mm; JLCPCB Part Class: 扩展库; Datasheet: https://atta.szlcsc.com/upload/public/pdf/source/20181120/C249784_89014CEAAF166358520D39DEDA814C8E.pdf; Supplier: LCSC; Tolerance: ±20%; Rated Voltage: 16V; φD: 6.3mm; L: 5.3mm; Lifetime @ Temp: 1000hrs@105℃; Operating Temperature: -45℃~+105℃
U1 = CH334R: Supplier Part: C4154405; Manufacturer: WCH(南京沁恒); Supplier Footprint: QSOP-16-150mil; JLCPCB Part Class: 扩展库; Supplier: LCSC
USB1 = TYPE-C 16PIN 2MD(073): 连接器类型:Type-C;标准:-;公母:母;端口数量:1;触点数量:16P;安装方式:卧贴;额定电流 - 电源:5A;工作温度范围:-25℃~+85℃;; LCSC Part Name: Type-C 母 卧贴 带定位柱 不锈钢外壳 2次模顶; Supplier Part: C2765186; Manufacturer: SHOU HAN(首韩); Supplier Footprint: SMD; JLCPCB Part Class: 扩展库; Datasheet: https://atta.szlcsc.com/upload/public/pdf/source/20211123/39B17C16241EAC15C5E277BDA434118E.pdf; Supplier: LCSC; Connector Type: Type-C; Gender: 母; Number of Ports: 1; Number of Contacts: 16P; Mounting Style: 卧贴; Current Rating - Power (Max): 5A; Operating Temperature Range: -25℃~+85℃
USB2 USB3 = U-USBAR04P-F002: 连接器类型:Type-A;标准:USB 2.0;公母:母;端口数量:1;触点数量:4P;安装方式:弯插;额定电流 - 电源:1.5A;工作温度范围:0℃~+50℃;; LCSC Part Name: Type-A 母 弯插; Supplier Part: C386736; Manufacturer: Ckmtw(灿科盟); Supplier Footprint: 插件; JLCPCB Part Class: 扩展库; Datasheet: https://atta.szlcsc.com/upload/public/pdf/source/20190613/C386736_D4BE393BB14E5933BBD1B61F2FF851F7.pdf; Supplier: LCSC; Connector Type: Type-A; Standard: USB 2.0; Gender: 母; Number of Ports: 1; Number of Contacts: 4P; Mounting Style: 弯插; Current Rating - Power (Max): 1.5A; Operating Temperature Range: 0℃~+50℃
X1 = X322512MSB4SI: 晶振类型:贴片晶振;频率:12MHz;常温频差:±10ppm;外接负载电容:20pF;频率稳定度(全温):±30ppm;; LCSC Part Name: 12MHz ±10ppm 20pF; Supplier Part: C9002; Manufacturer: YXC(扬兴晶振); Supplier Footprint: SMD3225-4P; JLCPCB Part Class: 基础库; Datasheet: https://atta.szlcsc.com/upload/public/pdf/source/20210329/C112971_1F611BDC486E193C1706F6D8EB5AA189.pdf; Supplier: LCSC; Crystal Type: 贴片晶振; Normal temperature Frequency Tolerance: ±10ppm; External load capacitor: 20pF; Frequency Stability(Full temperature range): ±30ppm; Operating Temperature: -40℃~+85℃

## Nets
3V3: C1.2 C2.2 C16.2 C17.2 C30.2 C31.2 CN2.2 H1.1 H2.4 L1.2 R4.2 R6.2 R7.1 R8.1 R12.1 R15.2 R24.1 R35.1 R36.2 R37.2 R38.2 U2.1(VBAT) U2.9(VDDA) U2.24(VDD_1) U2.36(VDD_2) U2.48(VDD_3) U4.1(VBAT) U4.9(VDDA) U4.24(VDD_1) U4.36(VDD_2) U4.48(VDD_3) U6.1(A) U7.1(A) U8.5(VCC) U9.2(VDD)
GND: C1.1 C2.1 C3.1 C4.1 C5.1 C6.1 C7.1 C8.2 C9.1 C10.1 C11.1 C15.1 C16.1 C17.1 C22.2 C23.2 C24.1 C25.1 C26.1 C30.1 C31.1 CN2.1 CN2.7 H1.4 H2.6 LED1.1(K) LED2.1(K) R1.2 R2.2 R3.2 R13.2 R14.2 R34.2 U1.14(GND) U2.8(VSSA) U2.23(VSS_1) U2.35(VSS_2) U2.47(VSS_3) U3.2(GND) U4.8(VSSA) U4.23(VSS_1) U4.35(VSS_2) U4.47(VSS_3) U8.3(GND) U9.5(GND) USB1.1(GND) USB1.12(GND) USB1.13(SHELL) USB1.14(SHELL) USB2.4(GND) USB2.5(SH1) USB2.6(SH2) USB3.4(GND) USB3.5(SH1) USB3.6(SH2) X1.2(GND) X1.4(GND) X2.2(GND) X2.4(GND) X3.2(GND) X3.4(GND)
DAP-CDC: U4.21(PB10)
DAP-DTR: U4.31(PA10)
DAP-HID: U4.20(PB2)
DAP-MSC: U4.22(PB11)
DAP-NRST: C11.2 R36.1 U2.7(NRST) U4.18(PB0)
DAP-RTS: U4.30(PA9)
DAP-RUN: R17.2 U4.10(PA0-WKUP)
DAP-RX: R8.2 U2.30(PA9) U4.13(PA3)
DAP-SWCLK: U2.37(PA14) U4.26(PB13)
DAP-SWDIO: R16.1 U2.34(PA13) U4.25(PB12)
DAP-TX: R7.2 U2.31(PA10) U4.12(PA2)
DAPLINK-B0: H1.5 R14.1 U4.44(BOOT0)
DAPLINK-NRST: C24.2 H1.6 R4.1 U4.7(NRST)
DAPLINK-SWCLK: H1.3 U4.37(PA14)
DAPLINK-SWDIO: H1.2 U4.34(PA13)
DM1: U1.7(DM1) U4.32(PA11)
DM2: U1.5(DM2) U2.32(PA11)
DM3: U1.3(DM3) USB3.2(D-)
DM4: U1.1(DM4) USB2.2(D-)
DM-UP: U1.10(DMU) USB1.5(DN2) USB1.7(DN1)
DP1: R15.1 U1.8(DP1) U4.33(PA12)
DP2: R6.1 U1.6(DP2) U2.33(PA12)
DP3: U1.4(DP3) USB3.3(D+)
DP4: U1.2(DP4) USB2.3(D+)
DP-UP: U1.11(DPU) USB1.6(DP1) USB1.8(DP2)
I2C-SCL: CN2.3 R37.1 U2.45(PB8) U9.3(SCL)
I2C-SDA: CN2.4 R38.1 U2.46(PB9) U9.4(SDA)
PB0: CN2.12 U2.18(PB0)
PB10: CN2.5 U2.21(PB10)
PB11: CN2.6 U2.22(PB11)
RS485-A: CN1.1 R19.2 R20.1 U5.6(A)
RS485-B: CN1.2 R19.1 R21.2 U5.7(B)
RS485-DE_RE: R22.1 U5.2(#RE) U5.3(DE) U6.4(VO)
RS485-DI: R23.1 U5.4(DI) U7.4(VO)
RS485-GND: H2.1 R21.1 R34.1 U5.5(GND) U6.3(GND) U7.3(GND)
RS485-RO: R27.1 U5.1(RO)
RS485-VCC: H2.2 R20.2 R22.2 R23.2 R35.2 U5.8(VCC) U6.5(VCC) U7.5(VCC) U8.1(A)
SPI-CLK: CN2.10 U2.15(PA5)
SPI-MISO: CN2.9 U2.16(PA6)
SPI-MOSI: CN2.8 U2.17(PA7)
SPI-NSS: CN2.11 U2.14(PA4)
UART-RTS: R31.2 U2.11(PA1)
UART-RX: R24.2 U2.13(PA3) U8.4(VO)
UART-TX: R28.2 U2.12(PA2)
USB-VBUS: C5.2 C6.2 C15.2 C22.1 C23.1 H2.5 R11.2 U1.12(V5) U3.4(IN) USB1.2(VBUS) USB1.11(VBUS) USB2.1(VCC) USB3.1(VCC)
$1N253: C3.2 C4.2 U1.13(VDD33)
$1N699: C7.2 U1.16(XI) X1.3(OSC2)
$1N932: R1.1 USB1.10(CC2)
$1N933: R2.1 USB1.4(CC1)
$1N978: C8.1 U1.15(XO) X1.1(OSC1)
$2N755: L1.1 U3.3(LX)
$2N758: R11.1 U3.1(EN)
$2N763: R12.2 R13.1 U3.5(FB)
$3N854: C26.2 U4.6(OSC_OUT) X2.1
$3N1016: C25.2 U4.5(OSC_IN) X2.3
$3N1490: R16.2 U4.27(PB14)
$3N1914: LED1.2(A) R17.1
$4N336: C10.2 U2.6(OSC_OUT) X3.1
$4N370: C9.2 U2.5(OSC_IN) X3.3
$4N637: R3.1 U2.44(BOOT0)
$4N993: LED2.2(A) R18.1
$4N1000: R18.2 U2.10(PA0-WKUP)
$5N963: R25.2 U8.2(C)
$5N966: R25.1 R26.1
$5N1012: R26.2 R27.2
$5N1138: R28.1 R29.1
$5N1140: R29.2 R30.2
$5N1150: R30.1 U7.2(C)
$5N1267: R31.1 R32.1
$5N1269: R32.2 R33.2
$5N1278: R33.1 U6.2(C)

Not connected (* = marked no-connect by the designer): H2 3*; U1 9(RESET#/CDP)*; U2 2(PC13-TAMPERRTC) 3(PC14-OSC32_IN) 4(PC15-OSC32_OUT) 19(PB1) 20(PB2) 25(PB12) 26(PB13) 27(PB14) 28(PB15) 29(PA8) 38(PA15) 39(PB3) 40(PB4) 41(PB5) 42(PB6) 43(PB7); U4 2(PC13-TAMPERRTC) 3(PC14-OSC32_IN) 4(PC15-OSC32_OUT) 11(PA1) 14(PA4) 15(PA5) 16(PA6) 17(PA7) 19(PB1) 28(PB15) 29(PA8) 38(PA15) 39(PB3) 40(PB4) 41(PB5) 42(PB6) 43(PB7) 45(PB8) 46(PB9); U9 1(NC)* 6(NC)*; USB1 3(SBU2)* 9(SBU1)*

## Notes on the sheets
sheet 3
- DAPLink 有4个状态指示灯，源码可以自定义
  RUN状态灯 PA0
  HID状态灯 PB2
  CDC状态灯 PB10
  MSC状态灯 PB11
- 引脚定义：
  DAP_SWDIOPB12
  DAP_SWCLK PB13
  DAP_NRST PB0 DAP对外输出复位脚
  DAP_TX PA2
  DAP_RX PA3
  DAP_RTS PA9
  DAP_DTR PA10
- DAPLink主要有以下功能:
      1.对Core进行调试(包括编程，运行监测)。
      2.提供串口与Core通信。
  DAPLink的程序通常不会有较大的改变。
sheet 4
- 温湿度检测
- Core与DAPLink具有以下连接:
      1.SWD接口与复位接口
      2.UASRT1与DAPLink串口连接(TX、RX)
      3.BOOT0与DAPLink串口RTS连接
- 1.5K电阻默认应不焊接,仅当以下情况焊接:
     使用USB
     未使用内部上拉电阻
- Core对外接口:
      1.UART接口(半双工) UASRT2(PA1-RTS、PA2-TX、PA3-RX)
sheet 5
- 此处放置排针，实际应当焊接隔离电源模块。
  若不焊接,可选装0欧姆电阻
- UART空闲状态为高电平。
  故AB间应在空闲时大于200mV（判定接收1的阈值电压）。
  注意:
      中间的电阻并非终端电阻。
      RS485首尾仍需终端电阻。
